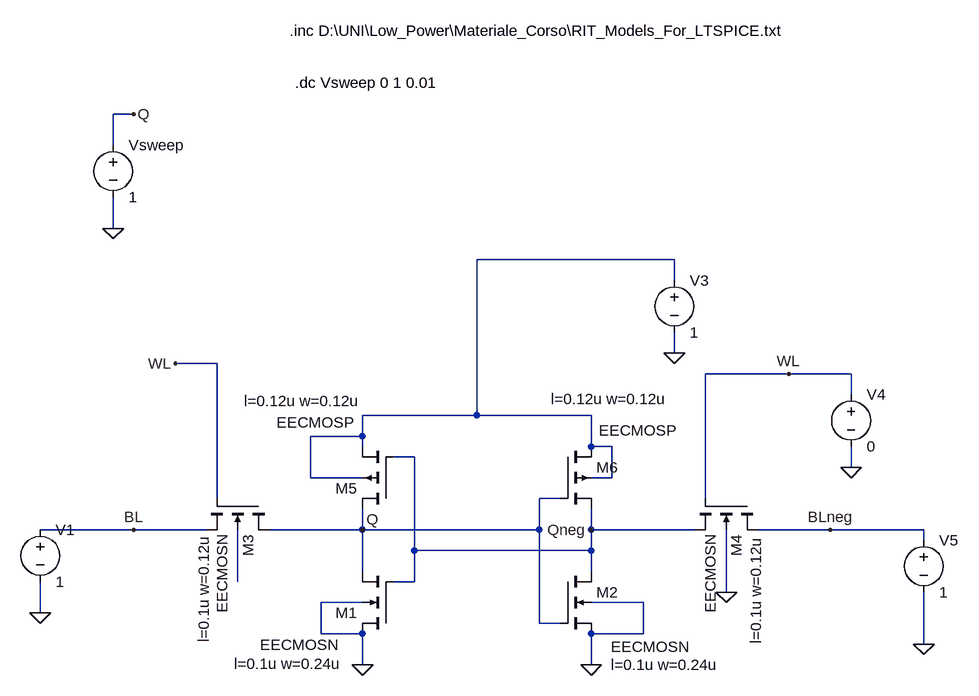
[diagram p0: schematic Draft1.asc]
Draft1.asc, the LTspice schematic file:
Version 4
SHEET 1 1192 1156
WIRE -80 64 -112 64
WIRE -112 112 -112 64
WIRE -112 240 -112 192
WIRE 752 288 448 288
WIRE 752 320 752 288
WIRE 752 432 752 400
WIRE 48 448 -16 448
WIRE 928 464 800 464
WIRE 1024 464 928 464
WIRE 1024 496 1024 464
WIRE 448 528 448 288
WIRE 448 528 272 528
WIRE 624 528 448 528
WIRE 272 560 272 528
WIRE 272 560 192 560
WIRE 272 576 272 560
WIRE 624 576 624 528
WIRE 656 576 624 576
WIRE 352 592 320 592
WIRE 1024 608 1024 576
WIRE 192 624 192 560
WIRE 272 624 192 624
WIRE 656 624 656 576
WIRE 656 624 624 624
WIRE 48 656 48 448
WIRE 576 656 544 656
WIRE 800 656 800 464
WIRE -80 704 -224 704
WIRE 32 704 -80 704
WIRE 272 704 272 672
WIRE 272 704 128 704
WIRE 544 704 544 656
WIRE 544 704 272 704
WIRE 624 704 624 672
WIRE 784 704 624 704
WIRE 992 704 880 704
WIRE 1136 704 992 704
WIRE 1136 720 1136 704
WIRE 352 736 352 592
WIRE 624 736 624 704
WIRE 624 736 352 736
WIRE 272 768 272 704
WIRE 624 768 624 736
WIRE 80 784 80 704
WIRE 352 784 352 736
WIRE 352 784 320 784
WIRE 832 800 832 704
WIRE 272 816 208 816
WIRE 704 816 624 816
WIRE -224 832 -224 784
WIRE 544 848 544 704
WIRE 576 848 544 848
WIRE 208 864 208 816
WIRE 272 864 208 864
WIRE 704 864 704 816
WIRE 704 864 624 864
WIRE 1136 880 1136 800
WIRE 272 912 272 864
WIRE 624 912 624 864
FLAG -224 832 0
FLAG -112 240 0
FLAG 272 912 0
FLAG 624 912 0
FLAG 1136 880 0
FLAG 832 800 0
FLAG 752 432 0
FLAG 1024 608 0
FLAG -80 64 Q
FLAG 272 704 Q
FLAG 624 704 Qneg
FLAG -80 704 BL
FLAG -16 448 WL
FLAG 928 464 WL
FLAG 992 704 BLneg
SYMBOL nmos4 320 864 R180
WINDOW 3 85 -17 Left 2
WINDOW 123 80 -46 Left 2
SYMATTR InstName M1
SYMATTR Value EECMOSN
SYMATTR Value2 l=0.1u w=0.24u
SYMBOL nmos4 576 768 R0
WINDOW 3 78 116 Left 2
WINDOW 123 78 144 Left 2
SYMATTR InstName M2
SYMATTR Value EECMOSN
SYMATTR Value2 l=0.1u w=0.24u
SYMBOL nmos4 128 656 R90
WINDOW 123 56 100 Left 2
SYMATTR InstName M3
SYMATTR Value EECMOSN
SYMATTR Value2 l=0.1u w=0.12u
SYMBOL nmos4 880 656 R90
WINDOW 123 58 2 Left 2
SYMATTR InstName M4
SYMATTR Value EECMOSN
SYMATTR Value2 l=0.1u w=0.12u
SYMBOL pmos4 320 672 R180
WINDOW 3 61 133 Left 2
WINDOW 123 51 166 Left 2
SYMATTR InstName M5
SYMATTR Value EECMOSP
SYMATTR Value2 l=0.12u w=0.12u
SYMBOL pmos4 576 576 R0
WINDOW 3 60 -25 Left 2
WINDOW 123 -14 -73 Left 2
SYMATTR InstName M6
SYMATTR Value EECMOSP
SYMATTR Value2 l=0.12u w=0.12u
SYMBOL voltage -224 688 R0
WINDOW 123 0 0 Left 0
WINDOW 39 0 0 Left 0
SYMATTR InstName V1
SYMATTR Value 1
SYMBOL voltage -112 96 R0
SYMATTR InstName Vsweep
SYMATTR Value 1
SYMBOL voltage 752 304 R0
SYMATTR InstName V3
SYMATTR Value 1
SYMBOL voltage 1024 480 R0
SYMATTR InstName V4
SYMATTR Value 0
SYMBOL voltage 1136 704 R0
WINDOW 123 0 0 Left 0
WINDOW 39 0 0 Left 0
SYMATTR InstName V5
SYMATTR Value 1
TEXT 160 -64 Left 2 !.inc D:\\UNI\\Low_Power\\Materiale_Corso\\RIT_Models_For_LTSPICE.txt
TEXT 168 16 Left 2 !.dc Vsweep 0 1 0.01

The netlist it stands for:
* Draft1.asc
M1 0 Qneg Q 0 EECMOSN l=0.1u w=0.24u
M2 Qneg Q 0 0 EECMOSN l=0.1u w=0.24u
M3 Q WL BL N002 EECMOSN l=0.1u w=0.12u
M4 BLneg WL Qneg 0 EECMOSN l=0.1u w=0.12u
M5 Q Qneg N001 N001 EECMOSP l=0.12u w=0.12u
M6 N001 Q Qneg N001 EECMOSP l=0.12u w=0.12u
V1 BL 0 1
Vsweep Q 0 1
V3 N001 0 1
V4 WL 0 0
V5 BLneg 0 1
.model NMOS NMOS
.model PMOS PMOS
.lib standard.mos
.inc D:\UNI\Low_Power\Materiale_Corso\RIT_Models_For_LTSPICE.txt
.dc Vsweep 0 1 0.01
.backanno
.end

* Results of the author's LTspice run, read from the files saved beside the schematic
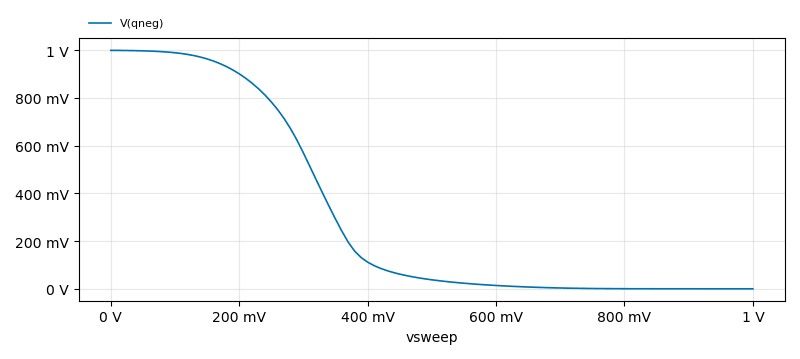
[diagram p1: DC transfer characteristic of Draft1.asc, plotted from the saved traces]
* DC transfer characteristic, 1 run:
*   V(qneg): 999.4 mV at vsweep=0 V, 36.37 µV at vsweep=1 V, min 36.37 µV, max 999.4 mV